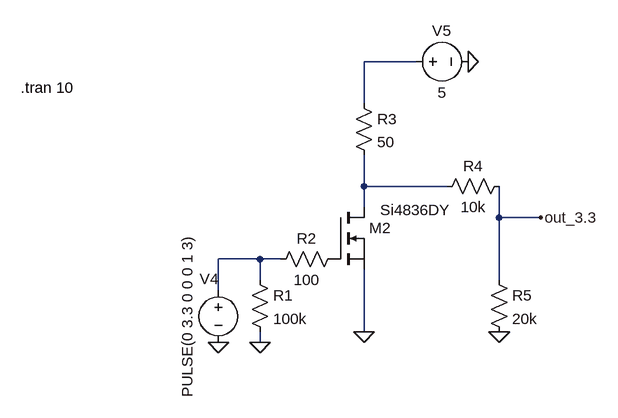
[diagram p0: schematic esp_out.asc]
esp_out.asc, the LTspice schematic file:
Version 4.1
SHEET 1 2740 1240
WIRE 1312 -224 1232 -224
WIRE 1232 -160 1232 -224
WIRE 1232 -32 1232 -80
WIRE 1360 -32 1232 -32
WIRE 1232 0 1232 -32
WIRE 1440 16 1440 -32
WIRE 1504 16 1440 16
WIRE 1072 80 1008 80
WIRE 1104 80 1072 80
WIRE 1072 112 1072 80
WIRE 1440 112 1440 16
WIRE 1008 128 1008 80
WIRE 1232 192 1232 96
WIRE 1072 208 1072 192
FLAG 1232 192 0
FLAG 1008 208 0
FLAG 1392 -224 0
FLAG 1072 208 0
FLAG 1440 192 0
FLAG 1504 16 out_3.3
SYMBOL nmos 1184 0 R0
WINDOW 3 181 4 Right 2
SYMATTR Value Si4836DY
SYMATTR InstName M2
SYMBOL voltage 1008 112 R0
WINDOW 0 -14 14 Bottom 2
WINDOW 3 -32 56 VBottom 2
WINDOW 123 0 0 Left 0
WINDOW 39 0 0 Left 0
SYMATTR InstName V4
SYMATTR Value PULSE(0 3.3 0 0 0 1 3)
SYMBOL voltage 1296 -224 R270
WINDOW 0 32 56 VTop 2
WINDOW 3 -32 56 VBottom 2
WINDOW 123 0 0 Left 0
WINDOW 39 0 0 Left 0
SYMATTR InstName V5
SYMATTR Value 5
SYMBOL res 1056 96 R0
SYMATTR InstName R1
SYMATTR Value 100k
SYMBOL res 1200 64 R90
WINDOW 0 0 56 VBottom 2
WINDOW 3 32 56 VTop 2
SYMATTR InstName R2
SYMATTR Value 100
SYMBOL res 1216 -176 R0
SYMATTR InstName R3
SYMATTR Value 50
SYMBOL res 1456 -48 R90
WINDOW 0 0 56 VBottom 2
WINDOW 3 32 56 VTop 2
SYMATTR InstName R4
SYMATTR Value 10k
SYMBOL res 1424 96 R0
SYMATTR InstName R5
SYMATTR Value 20k
TEXT 704 -184 Left 2 !.tran 10

The netlist it stands for:
* esp_out.asc
M2 N002 P001 0 0 Si4836DY
V4 N003 0 PULSE(0 3.3 0 0 0 1 3)
V5 N001 0 5
R1 N003 0 100k
R2 P001 N003 100
R3 N001 N002 50
R4 out_3.3 N002 10k
R5 out_3.3 0 20k
.model NMOS NMOS
.model PMOS PMOS
.lib standard.mos
.tran 10
.backanno
.end